# EAGLE schematic cpu (EAGLE 6.3)
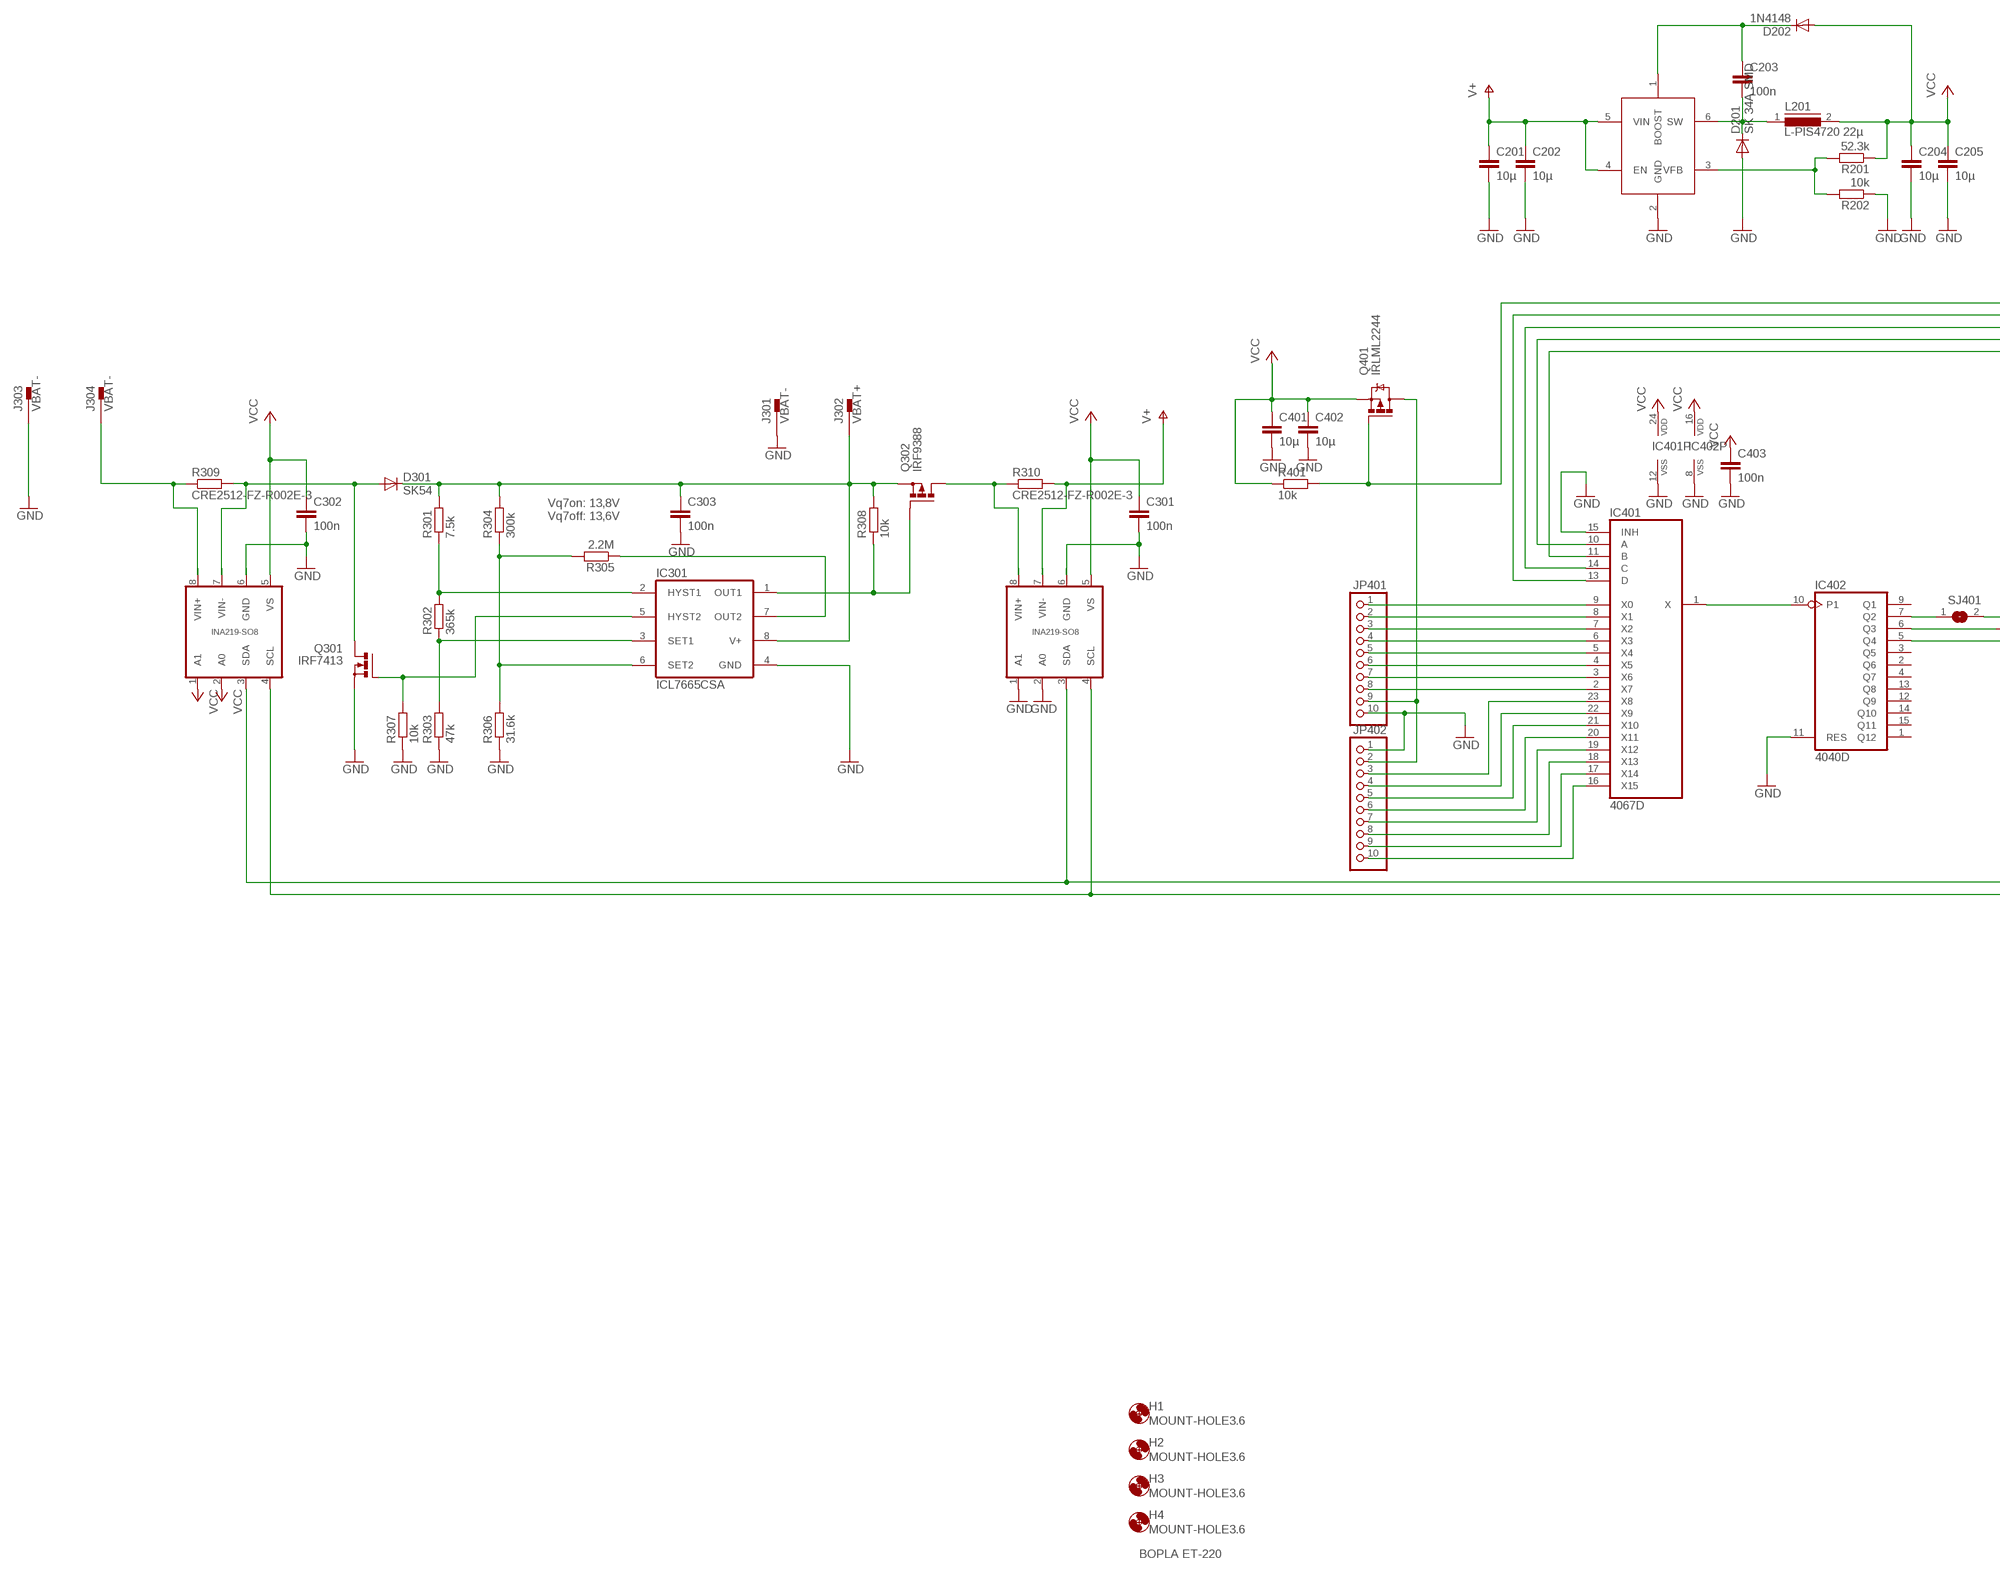
[diagram p0: schematic, sheet 1, part 1 of 2]
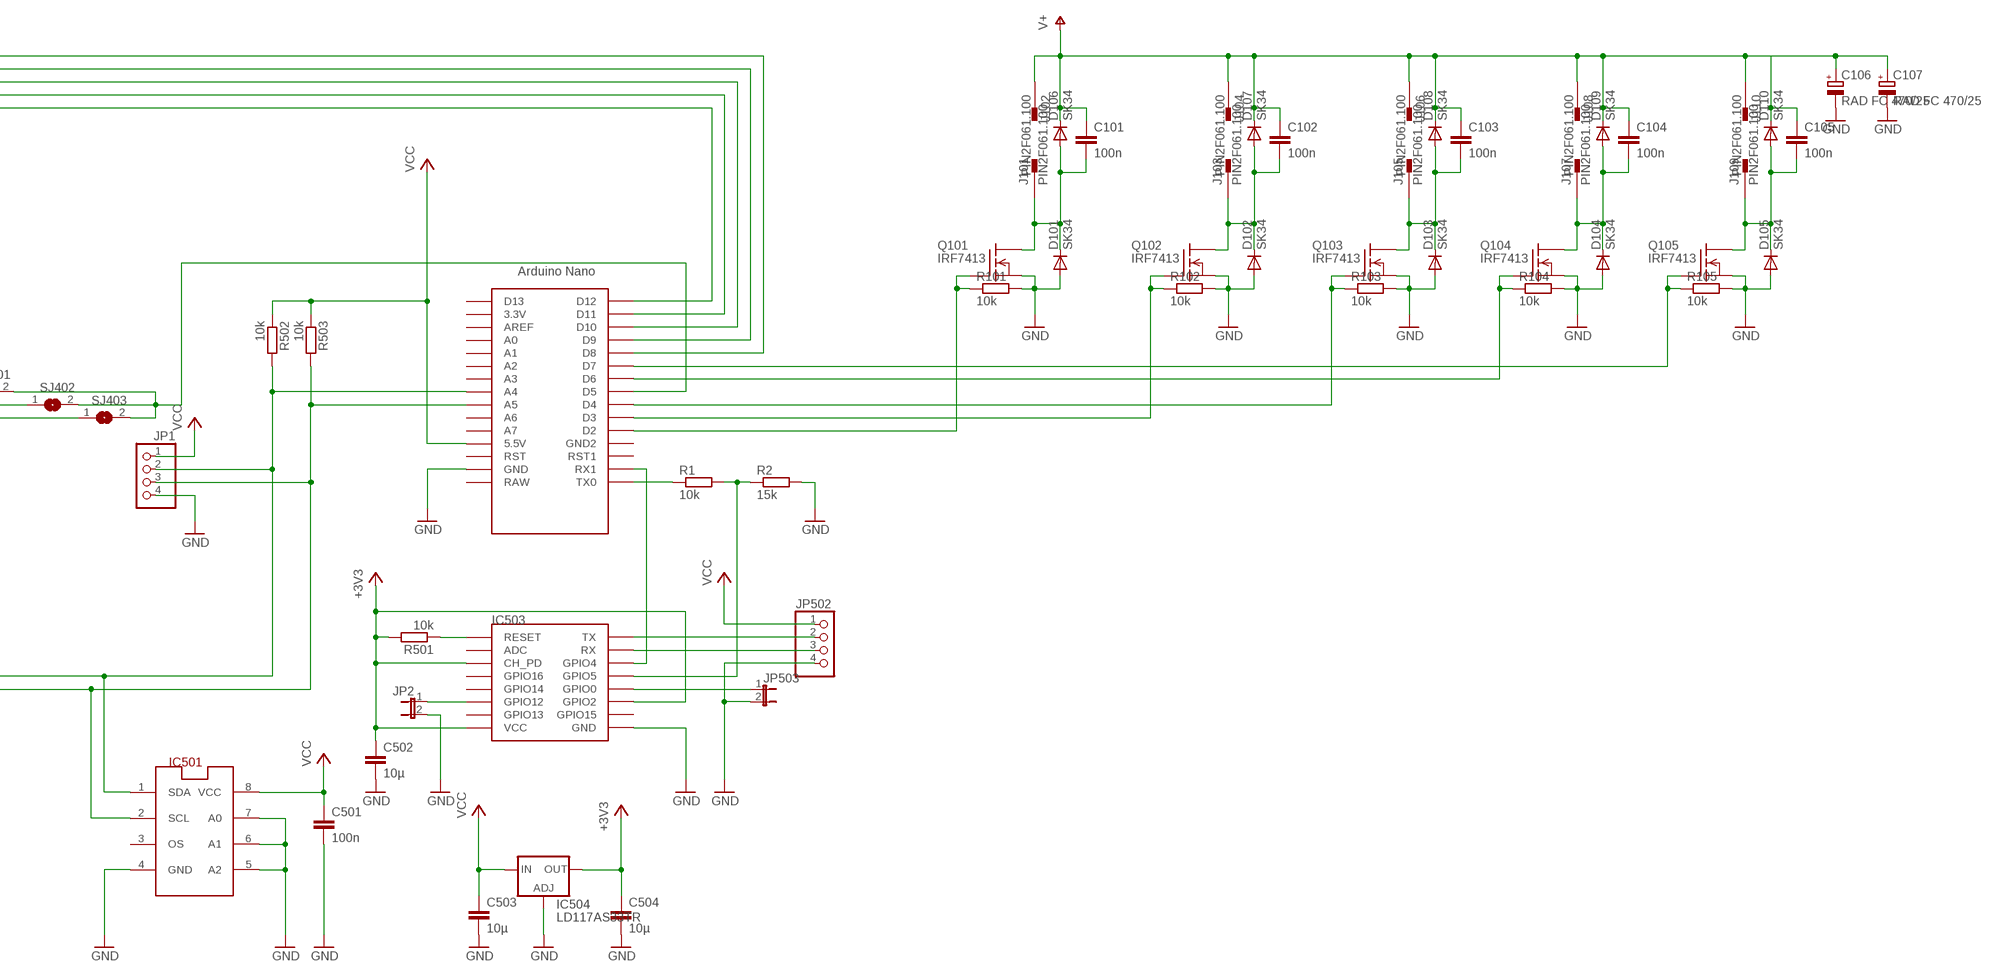
[diagram p1: schematic, sheet 1, part 2 of 2]

## Parts
C101  100n  C-EUC1206  [C1206]
C102  100n  C-EUC1206  [C1206]
C103  100n  C-EUC1206  [C1206]
C104  100n  C-EUC1206  [C1206]
C105  100n  C-EUC1206  [C1206]
C106  RAD FC 470/25  CPOL-EUE3.5-8  [E3,5-8]
C107  RAD FC 470/25  CPOL-EUE3.5-8  [E3,5-8]
C201  10µ  C-EUC1206  [C1206]
C202  10µ  C-EUC1206  [C1206]
C203  100n  C-EUC1206  [C1206]
C204  10µ  C-EUC1206  [C1206]
C205  10µ  C-EUC1206  [C1206]
C301  100n  C-EUC1206  [C1206]
C302  100n  C-EUC1206  [C1206]
C303  100n  C-EUC1206  [C1206]
C401  10µ  C-EUC1206  [C1206]
C402  10µ  C-EUC1206  [C1206]
C403  100n  C-EUC1206  [C1206]
C501  100n  C-EUC1206  [C1206]
C502  10µ  C-EUC1206  [C1206]
C503  10µ  C-EUC1206  [C1206]
C504  10µ  C-EUC1206  [C1206]
D101  SK34  DIODE-DO214BA  [DO214BA]
D102  SK34  DIODE-DO214BA  [DO214BA]
D103  SK34  DIODE-DO214BA  [DO214BA]
D104  SK34  DIODE-DO214BA  [DO214BA]
D105  SK34  DIODE-DO214BA  [DO214BA]
D106  SK34  DIODE-DO214BA  [DO214BA]
D107  SK34  DIODE-DO214BA  [DO214BA]
D108  SK34  DIODE-DO214BA  [DO214BA]
D109  SK34  DIODE-DO214BA  [DO214BA]
D110  SK34  DIODE-DO214BA  [DO214BA]
D201  SK 34A SMD  DIODE-DO214BA  [DO214BA]
D202  1N4148  DIODE-MINIMELF  [MINIMELF]
D301  SK54  DIODE-SMC  [SMC]
H1  MOUNT-HOLE3.6  [3,6]
H2  MOUNT-HOLE3.6  [3,6]
H3  MOUNT-HOLE3.6  [3,6]
H4  MOUNT-HOLE3.6  [3,6]
IC201  MCP16301/H  [SOT23-6]
IC301  ICL7665CSA  [SO08]
IC302  INA219-SO8D  [SO08]
IC303  INA219-SO8D  [SO08]
IC401  4067D  [SO24W]
IC402  4040D  [SO16]
IC501  LM75_ICN  [SO8_LM75]
IC502  NANO  [NANO]
IC503  ESP12SMD  [ESP12-SMD]
IC504  LD117AS33TR  [SOT223]
J101  PIN2F061.100  [F061.100]
J102  PIN2F061.100  [F061.100]
J103  PIN2F061.100  [F061.100]
J104  PIN2F061.100  [F061.100]
J105  PIN2F061.100  [F061.100]
J106  PIN2F061.100  [F061.100]
J107  PIN2F061.100  [F061.100]
J108  PIN2F061.100  [F061.100]
J109  PIN2F061.100  [F061.100]
J110  PIN2F061.100  [F061.100]
J301  VBAT-  PIN2F061.100  [F061.100]
J302  VBAT+  PIN2F061.100  [F061.100]
J303  VBAT-  PIN2F061.100  [F061.100]
J304  VBAT-  PIN2F061.100  [F061.100]
JP1  PINHD-1X4  [1X04]
JP2  JP1E  [JP1]
JP401  PINHD-1X10  [1X10]
JP402  PINHD-1X10  [1X10]
JP502  PINHD-1X4  [1X04]
JP503  JP1E  [JP1]
L201  L-PIS4720 22µ  DR74  [DR74]
Q101  IRF7413  FDS5680  [SO-8]
Q102  IRF7413  FDS5680  [SO-8]
Q103  IRF7413  FDS5680  [SO-8]
Q104  IRF7413  FDS5680  [SO-8]
Q105  IRF7413  FDS5680  [SO-8]
Q301  IRF7413  N-MOSFET-SO8S  [SO-08]
Q302  IRF9388  P-MOSFET-SO8  [SO-08]
Q401  IRLML2244  IRLML5203  [MICRO3]
R1  10k  R-EU_R0805  [R0805]
R2  15k  R-EU_R0805  [R0805]
R101  10k  R-EU_R0805  [R0805]
R102  10k  R-EU_R0805  [R0805]
R103  10k  R-EU_R0805  [R0805]
R104  10k  R-EU_R0805  [R0805]
R105  10k  R-EU_R0805  [R0805]
R201  52.3k  R-EU_R0805  [R0805]
R202  10k  R-EU_R0805  [R0805]
R301  7.5k  R-EU_R0805  [R0805]
R302  365k  R-EU_R0805  [R0805]
R303  47k  R-EU_R0805  [R0805]
R304  300k  R-EU_R0805  [R0805]
R305  2.2M  R-EU_R0805  [R0805]
R306  31.6k  R-EU_R0805  [R0805]
R307  10k  R-EU_R0805  [R0805]
R308  10k  R-EU_R0805  [R0805]
R309  CRE2512-FZ-R002E-3  R-EU_R2512  [R2512]
R310  CRE2512-FZ-R002E-3  R-EU_R2512  [R2512]
R401  10k  R-EU_R0805  [R0805]
R501  10k  R-EU_R0805  [R0805]
R502  10k  R-EU_R0805  [R0805]
R503  10k  R-EU_R0805  [R0805]
SJ401  SJW  [SJW]
SJ402  SJW  [SJW]
SJ403  SJW  [SJW]

## Nets
+3V3: C502.1 C504.1 IC503.CH_PD IC503.GPIO2 IC503.VCC IC504.4(OUT) R501.2
G-N: IC301.5(HYST2) Q301.4(G) R307.2
GND: C106.- C107.- C201.2 C202.2 C204.2 C205.2 C301.2 C302.2 C303.2 C401.2 C402.2 C403.2 C501.2 C502.2 C503.2 C504.2 D101.A D102.A D103.A D104.A D105.A D201.A IC201.2(GND) IC301.4(GND) IC302.6(GND) IC303.1(A1) IC303.2(A0) IC303.6(GND) IC401.12(VSS) IC401.15(INH) IC402.8(VSS) IC402.11(RES) IC501.4(GND) IC501.5(A2) IC501.6(A1) IC501.7(A0) IC502.GND IC503.GND IC504.1(ADJ) J301.A1 J301.A2 J303.A1 J303.A2 JP1.4 JP2.2 JP401.10 JP402.1 JP502.4 JP503.2 Q101.1(S) Q101.2(S) Q101.3(S) Q102.1(S) Q102.2(S) Q102.3(S) Q103.1(S) Q103.2(S) Q103.3(S) Q104.1(S) Q104.2(S) Q104.3(S) Q105.1(S) Q105.2(S) Q105.3(S) Q301.1(S) Q301.2(S) Q301.3(S) R2.2 R101.2 R102.2 R103.2 R104.2 R105.2 R202.1 R303.1 R306.1 R307.1
N$1: IC502.D6 Q104.4(G) R104.1
N$2: IC502.D4 Q103.4(G) R103.1
N$3: IC502.D3 Q102.4(G) R102.1
N$4: IC502.D2 Q101.4(G) R101.1
N$5: IC502.D7 Q105.4(G) R105.1
N$6: IC401.9(X0) JP401.1
N$7: IC401.8(X1) JP401.2
N$8: IC401.7(X2) JP401.3
N$9: IC401.6(X3) JP401.4
N$10: IC401.5(X4) JP401.5
N$11: IC401.4(X5) JP401.6
N$12: IC401.3(X6) JP401.7
N$13: IC401.2(X7) JP401.8
N$14: IC401.23(X8) JP402.3
N$15: IC401.22(X9) JP402.4
N$16: IC401.21(X10) JP402.5
N$17: IC401.20(X11) JP402.6
N$18: IC401.19(X12) JP402.7
N$19: IC401.18(X13) JP402.8
N$20: IC401.17(X14) JP402.9
N$21: IC401.16(X15) JP402.10
N$22: IC401.1(X) IC402.10(P1)
N$23: IC401.11(B) IC502.D12
N$24: IC402.7(Q2) SJ401.1
N$25: IC402.6(Q3) SJ402.1
N$26: IC402.5(Q4) SJ403.1
N$27: IC502.D5 SJ401.2 SJ402.2 SJ403.2
N$28: JP401.9 JP402.2 Q401.3(D)
N$29: IC502.RX1 IC503.GPIO4
N$30: IC502.D8 Q401.1(G) R401.2
N$31: C203.1 D202.C IC201.1(BOOST)
N$32: IC503.GPIO5 R1.2 R2.1
N$33: IC201.3(VFB) R201.2 R202.2
N$34: IC401.10(A) IC502.D11
N$35: IC503.RESET R501.1
N$36: IC401.14(C) IC502.D10
N$37: IC401.13(D) IC502.D9
N$38: IC503.GPIO0 JP503.1
N$40: IC503.TXD0(TX) JP502.2
N$41: IC503.RXD0(RX) JP502.3
N$42: IC303.8(VIN+) Q302.5(D) Q302.6(D) Q302.7(D) Q302.8(D) R310.1
N$43: IC502.TX0 R1.1
N$46: IC301.6(SET2) R304.1 R305.2 R306.2
N$47: IC301.3(SET1) R302.1 R303.2
N$48: IC301.2(HYST1) R301.1 R302.2
N$49: IC301.7(OUT2) R305.1
N$50: IC301.1(OUT1) Q302.4(G) R308.1
N$51: IC503.GPIO12 JP2.1
PUMP: C101.2 D101.C D106.A J101.A1 J101.A2 Q101.5(D) Q101.6(D) Q101.7(D) Q101.8(D)
SCL: IC302.4(SCL) IC303.4(SCL) IC501.2(SCL) IC502.A5 JP1.3 R503.2
SDA: IC302.3(SDA) IC303.3(SDA) IC501.1(SDA) IC502.A4 JP1.2 R502.2
SW: C203.2 D201.C IC201.6(SW) L201.1
V+: C101.1 C102.1 C103.1 C104.1 C105.1 C106.+ C107.+ C201.1 C202.1 D106.C D107.C D108.C D109.C D110.C IC201.4(EN) IC201.5(VIN) IC303.7(VIN-) J102.A1 J102.A2 J104.A1 J104.A2 J106.A1 J106.A2 J108.A1 J108.A2 J110.A1 J110.A2 R310.2
VBAT: C303.1 D301.C IC301.8(V+) J302.A1 J302.A2 Q302.1(S) Q302.2(S) Q302.3(S) R301.2 R304.2 R308.2
VCC: C204.1 C205.1 C301.1 C302.1 C401.1 C402.1 C403.1 C501.1 C503.1 D202.A IC302.1(A1) IC302.2(A0) IC302.5(VS) IC303.5(VS) IC401.24(VDD) IC402.16(VDD) IC501.8(VCC) IC502.5V(5.5V) IC504.3(IN) JP1.1 JP502.1 L201.2 Q401.2(S) R201.1 R401.1 R502.1 R503.1
VENT1: C102.2 D102.C D107.A J103.A1 J103.A2 Q102.5(D) Q102.6(D) Q102.7(D) Q102.8(D)
VENT2: C103.2 D103.C D108.A J105.A1 J105.A2 Q103.5(D) Q103.6(D) Q103.7(D) Q103.8(D)
VENT3: C104.2 D104.C D109.A J107.A1 J107.A2 Q104.5(D) Q104.6(D) Q104.7(D) Q104.8(D)
VENT4: C105.2 D105.C D110.A J109.A1 J109.A2 Q105.5(D) Q105.6(D) Q105.7(D) Q105.8(D)
VSOL: D301.A IC302.7(VIN-) Q301.5(D) Q301.6(D) Q301.7(D) Q301.8(D) R309.2
VSOLRAW: IC302.8(VIN+) J304.A1 J304.A2 R309.1
Unconnected: IC402.1(Q12) IC402.2(Q6) IC402.3(Q5) IC402.4(Q7) IC402.9(Q1) IC402.12(Q9) IC402.13(Q8) IC402.14(Q10) IC402.15(Q11) IC501.3(OS) IC502.3.3V IC502.A0 IC502.A1 IC502.A2 IC502.A3 IC502.A6 IC502.A7 IC502.AREF IC502.D13 IC502.GND1(GND2) IC502.ICSP1 IC502.ICSP2 IC502.ICSP3 IC502.ICSP4 IC502.ICSP5 IC502.ICSP6 IC502.RAW IC502.RST IC502.RST1 IC503.ADC IC503.GPIO13 IC503.GPIO14 IC503.GPIO15 IC503.GPIO16

## Notes on the sheet
- Vq7on: 13,8V
  Vq7off: 13,6V
- BOPLA ET-220

## Library data of the parts
C101-C105 C201-C205 C301-C303 C401-C403 C501-C504 = rcl:C-EU: CAPACITOR, European symbol
C106 C107 = rcl:CPOL-EU: POLARIZED CAPACITOR, European symbol
D101-D110 D201 D202 D301 = diode:DIODE-: DIODE
H1-H4 = holes:MOUNT-HOLE: MOUNTING HOLE with drill center marker
IC201 = MCP16301:MCP16301/H: High-Voltage Input Integrated Switch Step-Down Regulator
IC301 = maxim:ICL7665CSA: UNDER/OVER VOLTAGE DETECTOR; MPN: ICL7665CSA+; OC_FARNELL: unknown; OC_NEWARK: 19M9537
IC302 IC303 = INA219 :INA219-SO8: INA219 Bi-Directional CURRENT/POWER MONITOR with I2C™ Interface http://www.ti.com/lit/ds/symlink/ina219.pdf
IC401 = 40xx:4067: 16-channel ANALOG MULTIPLEXER
IC402 = 40xx:4040: 12-stage binary/ripple COUNTER
IC501 = lm75:LM75_IC: Temperatursensor
IC502 = Arduino-clone:NANO: Arduino Nano
IC503 = esp8266modules:ESP12: ESP8266 Wifi module 12
IC504 = v-reg:LD117A?*: Low drop fixed and adjustable positive voltage regulators 1 A Source: http://www.st.com/stonline/products/literature/ds/7194/ld1117axx.pdf
J101-J110 J301-J304 = con-faston:PIN2: Flachstecker Typ Tyco/Electronics/AMP TAB, FASTON Printed Circuit Board Tabs Source: http://www.buerklin.com, http://catalog.tycoelectronics.com; OC_FARNELL: unknown; OC_NEWARK: unknown
JP1 JP502 = pinhead:PINHD-1X4: PIN HEADER
JP2 JP503 = jumper:JP1E: JUMPER
JP401 JP402 = pinhead:PINHD-1X10: PIN HEADER
L201 = inductors:DR74: High Power Density, High Efficiency, Shielded Inductors Source: coiltronics_dr_series.pdf
Q101-Q105 = transistor-fet:FDS5680: 60V N-Channel PowerTrench TM MOSFET FAIRCHILD FDS5680.pdf
Q301 = transistor-power:N-MOSFET-SO8: N-Channel MOSFET Example: FDS7760A; N-Channel Logic Level PowerTrench® MOSFET FDS2572; N-Channel UltraFET® Trench MOSFET Source: www.fairchildsemi.com
Q302 = transistor-power:P-MOSFET-SO8: P-Channel MOSFET Example: FDS4435A; P-Channel Logic Level PowerTrench® MOSFET FDS4465; P-Channel 1.8V Specified PowerTrench® MOSFET Source: www.fairchildsemi.com
Q401 = transistor-power:IRLML5203: HEXFET P-Channel Power MOSFET
R1 R2 R101-R105 R201 R202 R301-R310 R401 R501-R503 = rcl:R-EU_: RESISTOR, European symbol
SJ401-SJ403 = jumper:SJ: SMD solder JUMPER